# Altium schematic sheet LPCB221 - OVERVIEW.SchDoc
size A3; Address1: Factory 10; Address2: 9-13 Dingley Avenue, Dandeong, VICTORIA 3175, AUSTRALIA; DocumentNumber: 1; Revision: 1; SheetNumber: 1; SheetTotal: 6; Lockie__PCB_SUB_ASSEMBLY: Overview; Lockie__PCB_ASSEMBLY: Node Base; Lockie__LDL: LPCB221; Lockie__PCB_DESCRIPTION: Gimbal Node
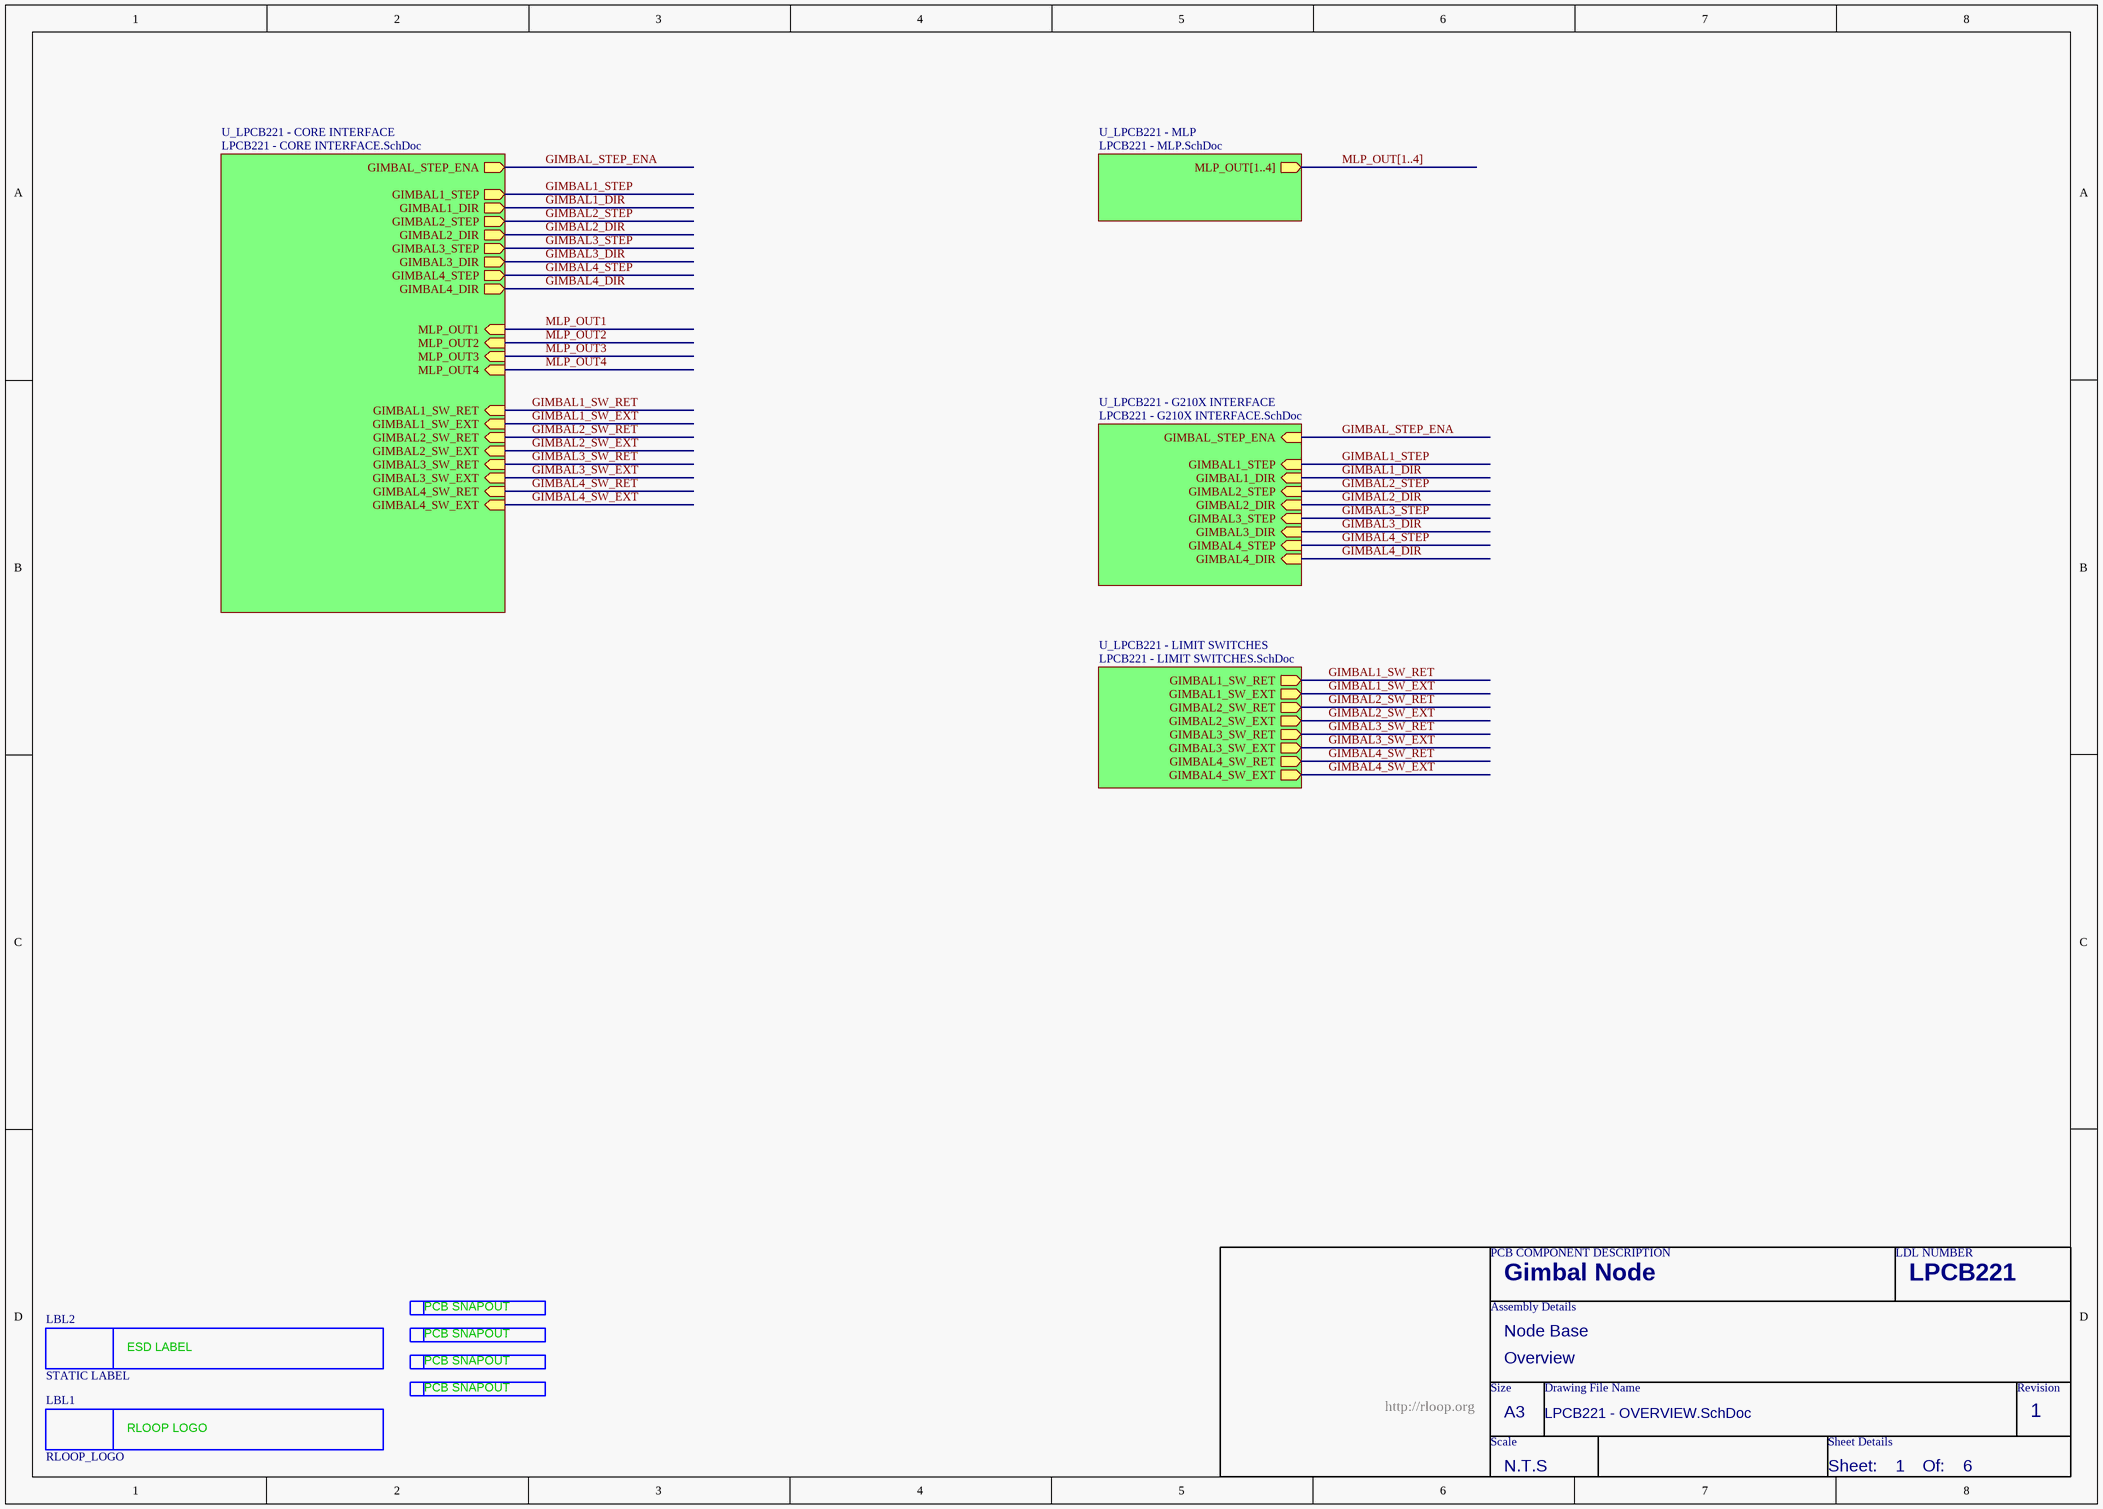
[diagram p0: LPCB221 - OVERVIEW.SchDoc]

## Parts
LBL1  RLOOP_LOGO  [RLOOP_LOGO]  (no BOM)
LBL2  STATIC LABEL  [STATIC_LABEL]  (no BOM)
SN1  PCB_SNAPOUT  [SNAPOUT_NEW]  (value not drawn)  (no BOM)
SN2  PCB_SNAPOUT  [SNAPOUT_NEW]  (value not drawn)  (no BOM)
SN3  PCB_SNAPOUT  [SNAPOUT_NEW]  (value not drawn)  (no BOM)
SN4  PCB_SNAPOUT  [SNAPOUT_NEW]  (value not drawn)  (no BOM)

## Sub-sheets
U_LPCB221 - CORE INTERFACE = LPCB221 - CORE INTERFACE.SchDoc: GIMBAL_STEP_ENA (out), GIMBAL2_DIR (out), GIMBAL1_STEP (out), GIMBAL2_STEP (out), GIMBAL1_DIR (out), GIMBAL4_DIR (out), GIMBAL3_STEP (out), GIMBAL4_STEP (out), GIMBAL3_DIR (out), MLP_OUT1 (in), MLP_OUT2 (in), MLP_OUT3 (in), MLP_OUT4 (in), GIMBAL1_SW_RET (in), GIMBAL1_SW_EXT (in), GIMBAL2_SW_RET (in), GIMBAL2_SW_EXT (in), GIMBAL3_SW_RET (in), GIMBAL3_SW_EXT (in), GIMBAL4_SW_RET (in), GIMBAL4_SW_EXT (in)
U_LPCB221 - G210X INTERFACE = LPCB221 - G210X INTERFACE.SchDoc: GIMBAL_STEP_ENA (in), GIMBAL2_DIR (in), GIMBAL1_STEP (in), GIMBAL2_STEP (in), GIMBAL1_DIR (in), GIMBAL4_DIR (in), GIMBAL3_STEP (in), GIMBAL4_STEP (in), GIMBAL3_DIR (in)
U_LPCB221 - LIMIT SWITCHES = LPCB221 - LIMIT SWITCHES.SchDoc: GIMBAL1_SW_RET (out), GIMBAL1_SW_EXT (out), GIMBAL2_SW_RET (out), GIMBAL2_SW_EXT (out), GIMBAL3_SW_RET (out), GIMBAL3_SW_EXT (out), GIMBAL4_SW_RET (out), GIMBAL4_SW_EXT (out)
U_LPCB221 - MLP = LPCB221 - MLP.SchDoc: MLP_OUT[1..4] (out)

## Nets
GIMBAL1_DIR: sheet U_LPCB221 - G210X INTERFACE/GIMBAL1_DIR, sheet U_LPCB221 - CORE INTERFACE/GIMBAL1_DIR
GIMBAL1_STEP: sheet U_LPCB221 - G210X INTERFACE/GIMBAL1_STEP, sheet U_LPCB221 - CORE INTERFACE/GIMBAL1_STEP
GIMBAL1_SW_EXT: sheet U_LPCB221 - LIMIT SWITCHES/GIMBAL1_SW_EXT, sheet U_LPCB221 - CORE INTERFACE/GIMBAL1_SW_EXT
GIMBAL1_SW_RET: sheet U_LPCB221 - LIMIT SWITCHES/GIMBAL1_SW_RET, sheet U_LPCB221 - CORE INTERFACE/GIMBAL1_SW_RET
GIMBAL2_DIR: sheet U_LPCB221 - G210X INTERFACE/GIMBAL2_DIR, sheet U_LPCB221 - CORE INTERFACE/GIMBAL2_DIR
GIMBAL2_STEP: sheet U_LPCB221 - G210X INTERFACE/GIMBAL2_STEP, sheet U_LPCB221 - CORE INTERFACE/GIMBAL2_STEP
GIMBAL2_SW_EXT: sheet U_LPCB221 - LIMIT SWITCHES/GIMBAL2_SW_EXT, sheet U_LPCB221 - CORE INTERFACE/GIMBAL2_SW_EXT
GIMBAL2_SW_RET: sheet U_LPCB221 - LIMIT SWITCHES/GIMBAL2_SW_RET, sheet U_LPCB221 - CORE INTERFACE/GIMBAL2_SW_RET
GIMBAL3_DIR: sheet U_LPCB221 - G210X INTERFACE/GIMBAL3_DIR, sheet U_LPCB221 - CORE INTERFACE/GIMBAL3_DIR
GIMBAL3_STEP: sheet U_LPCB221 - G210X INTERFACE/GIMBAL3_STEP, sheet U_LPCB221 - CORE INTERFACE/GIMBAL3_STEP
GIMBAL3_SW_EXT: sheet U_LPCB221 - LIMIT SWITCHES/GIMBAL3_SW_EXT, sheet U_LPCB221 - CORE INTERFACE/GIMBAL3_SW_EXT
GIMBAL3_SW_RET: sheet U_LPCB221 - LIMIT SWITCHES/GIMBAL3_SW_RET, sheet U_LPCB221 - CORE INTERFACE/GIMBAL3_SW_RET
GIMBAL4_DIR: sheet U_LPCB221 - G210X INTERFACE/GIMBAL4_DIR, sheet U_LPCB221 - CORE INTERFACE/GIMBAL4_DIR
GIMBAL4_STEP: sheet U_LPCB221 - G210X INTERFACE/GIMBAL4_STEP, sheet U_LPCB221 - CORE INTERFACE/GIMBAL4_STEP
GIMBAL4_SW_EXT: sheet U_LPCB221 - LIMIT SWITCHES/GIMBAL4_SW_EXT, sheet U_LPCB221 - CORE INTERFACE/GIMBAL4_SW_EXT
GIMBAL4_SW_RET: sheet U_LPCB221 - LIMIT SWITCHES/GIMBAL4_SW_RET, sheet U_LPCB221 - CORE INTERFACE/GIMBAL4_SW_RET
GIMBAL_STEP_ENA: sheet U_LPCB221 - G210X INTERFACE/GIMBAL_STEP_ENA, sheet U_LPCB221 - CORE INTERFACE/GIMBAL_STEP_ENA
MLP_OUT1: sheet U_LPCB221 - CORE INTERFACE/MLP_OUT1
MLP_OUT2: sheet U_LPCB221 - CORE INTERFACE/MLP_OUT2
MLP_OUT3: sheet U_LPCB221 - CORE INTERFACE/MLP_OUT3
MLP_OUT4: sheet U_LPCB221 - CORE INTERFACE/MLP_OUT4

## Buses and harness runs
bus MLP_OUT[1..4] = sheet U_LPCB221 - MLP/MLP_OUT[1..4]

## Notes on the sheet
- PCB COMPONENT DESCRIPTION
- LDL NUMBER
- Assembly Details
- Size
- Drawing File Name
- Revision
- http://rloop.org
- Scale
- A3
- Sheet Details
- N.T.S
- Sheet:
- Of:
- (in symbol PCB_SNAPOUT) PCB SNAPOUT
- (in symbol RLOOP_LOGO) RLOOP LOGO
- (in symbol STATIC LABEL) ESD LABEL

## Library data of the parts
LBL1 = RLOOP_LOGO: FMEDA__CHANNEL: DIAG; FMEDA__FUNCTION_IN_SYSTEM: *
LBL2 = STATIC LABEL: FMEDA__CHANNEL: DIAG; FMEDA__FUNCTION_IN_SYSTEM: *
SN1-SN4 = PCB_SNAPOUT: FMEDA__CHANNEL: DIAG; FMEDA__FUNCTION_IN_SYSTEM: *